# EAGLE design Maverick 1 (EAGLE 9.6.2)
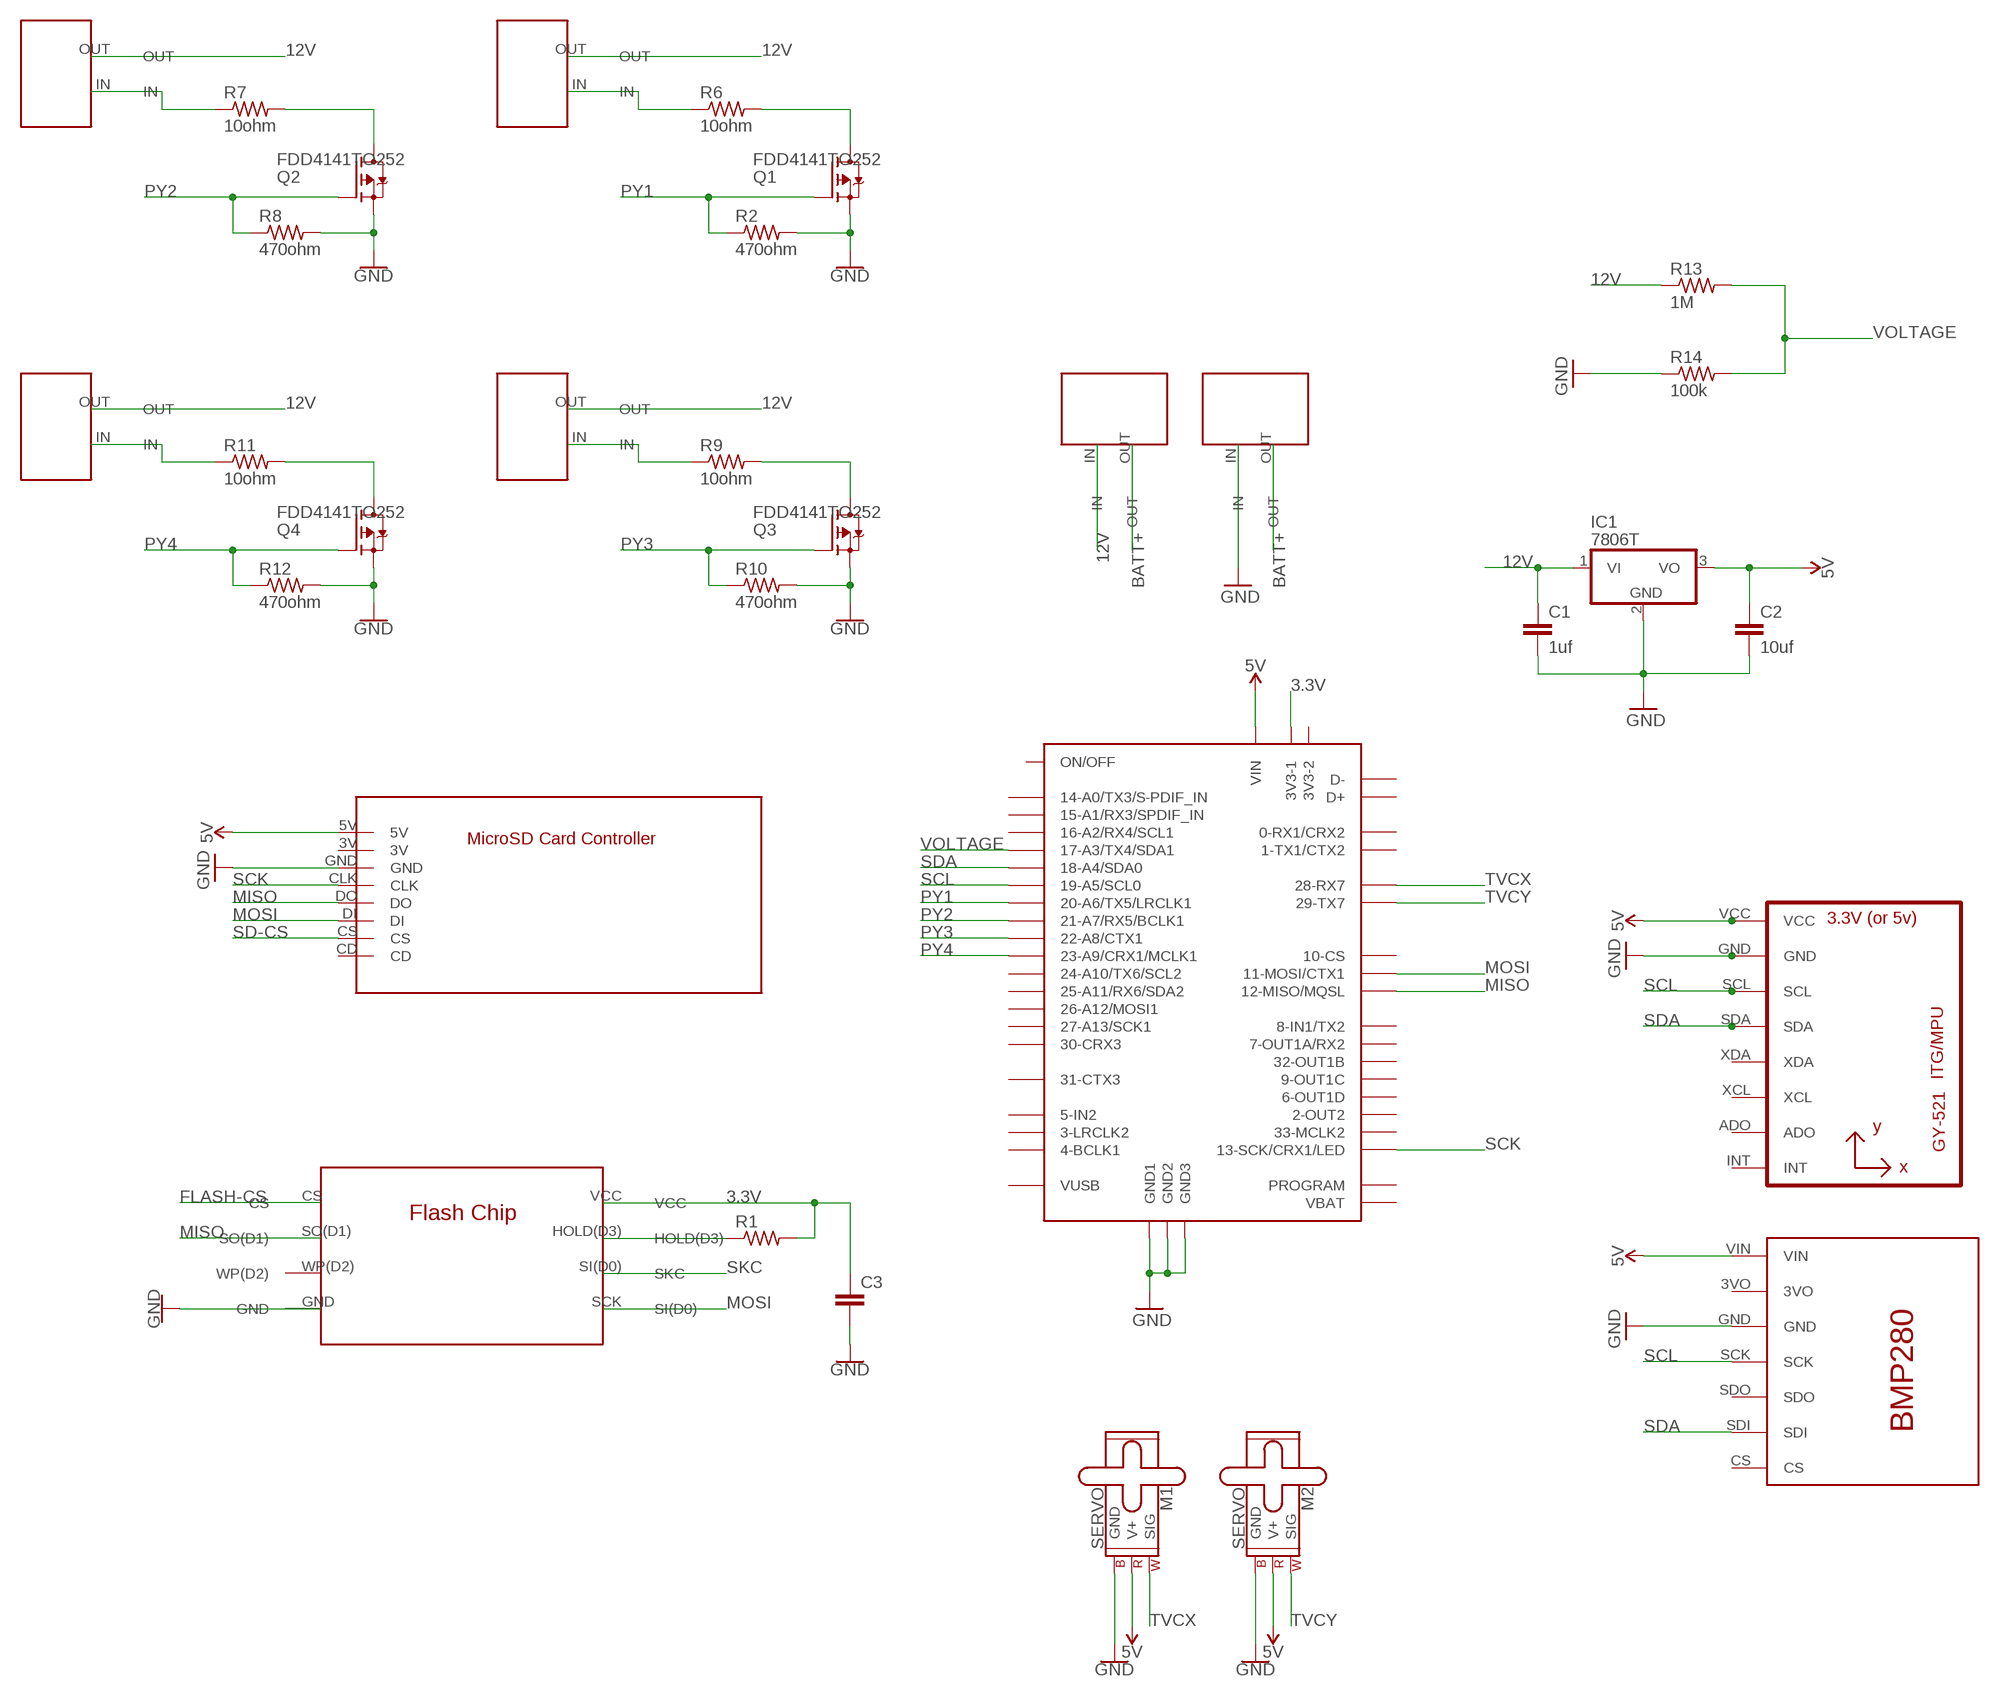
[diagram p0: schematic, sheet 1]

## Parts
C1  1uf  C2,5-3  [C2.5-3]
C2  10uf  C2,5-3  [C2.5-3]
C3  C2,5-3  [C2.5-3]
IC1  7806T  [TO220H]
M1  SERVO  [1X03]
M2  SERVO  [1X03]
Q1  FDD4141TO252  [TO252]
Q2  FDD4141TO252  [TO252]
Q3  FDD4141TO252  [TO252]
Q4  FDD4141TO252  [TO252]
R1  R-US_0411/3V  [0411V]
R2  470ohm  R-US_0411/15  [0411/15]
R6  10ohm  R-US_0411/3V  [0411V]
R7  10ohm  R-US_0411/3V  [0411V]
R8  470ohm  R-US_0411/15  [0411/15]
R9  10ohm  R-US_0411/3V  [0411V]
R10  470ohm  R-US_0411/15  [0411/15]
R11  10ohm  R-US_0411/3V  [0411V]
R12  470ohm  R-US_0411/15  [0411/15]
R13  1M  R-US_0411/15  [0411/15]
R14  100k  R-US_0411/15  [0411/15]
U4  GY-521MPU6050  [GY-521]
U$1  TEENSY40  [TEENSY40]
U$2  BMP280  [BMP280]
U$3  SDCARDHOLDER  [SDCARDHOLDER]
U$4  FLASHCHIP  [FLASHCHIP]
U$6  TERMBLOCK  [TERMBLOCK]
U$7  TERMBLOCK  [TERMBLOCK]
U$8  TERMBLOCK  [TERMBLOCK]
U$9  TERMBLOCK  [TERMBLOCK]
U$10  TERMBLOCK  [TERMBLOCK]
U$11  TERMBLOCK  [TERMBLOCK]

## Nets
3.3V: C3.1 R1.2 U$1.3V3-1 U$4.VCC
5V: C2.1 IC1.3(VO) M1.2(V+) M2.2(V+) U4.VCC U$1.VIN U$2.VIN U$3.5V
12V: C1.1 IC1.1(VI) R13.1 U$6.OUT U$7.OUT U$8.OUT U$9.OUT U$11.IN
BATT+: U$10.OUT U$11.OUT
FLASH-CS: U$4.CS
GND: C1.2 C2.2 C3.2 IC1.2(GND) M1.3(GND) M2.3(GND) Q1.2(S) Q2.2(S) Q3.2(S) Q4.2(S) R2.2 R8.2 R10.2 R12.2 R14.1 U4.GND U$1.GND1 U$1.GND2 U$1.GND3 U$2.GND U$3.GND U$4.GND U$10.IN
MISO: U$1.12-MIO/MQSL(12-MISO/MQSL) U$3.DO U$4.SO(D1)
MOSI: U$1.11-MOSI/CTX1 U$3.DI U$4.SCK(SI(D0))
N$1: R1.1 U$4.HOLD(D3)
N$9: Q1.3(D) R6.2
N$10: R6.1 U$6.IN
N$12: R7.1 U$7.IN
N$13: Q2.3(D) R7.2
N$15: R9.1 U$8.IN
N$16: Q3.3(D) R9.2
N$18: R11.1 U$9.IN
N$19: Q4.3(D) R11.2
PY1: Q1.1(G) R2.1 U$1.20-A6/TX5/LRCLK1
PY2: Q2.1(G) R8.1 U$1.21-A7/RX5/BCLK1
PY3: Q3.1(G) R10.1 U$1.22-A8/CTX1
PY4: Q4.1(G) R12.1 U$1.23-A9/CRX1/CCLK1(23-A9/CRX1/MCLK1)
SCK: U$1.13-SCK/CRX1/LED U$3.CLK
SCL: U4.SCL U$1.19-A5/SCL0 U$2.SCK
SD-CS: U$3.CS
SDA: U4.SDA U$1.18-A4/SDA0 U$2.SDI
SKC: U$4.SI(D0)(SKC)
TVCX: M1.1(SIG) U$1.28-RX7
TVCY: M2.1(SIG) U$1.29-TX7
VOLTAGE: R13.2 R14.2 U$1.17-A3/TX4/SDA1
Unconnected: U4.ADO U4.INT U4.XCL U4.XDA U$1.0-RX1(0-RX1/CRX2) U$1.1-TX1(1-TX1/CTX2) U$1.2-OUT2 U$1.3-LRCLK2 U$1.3V3-2 U$1.4-BCLK2(4-BCLK1) U$1.5-IN2 U$1.6-OUT1D U$1.7-RX2/OUT1A(7-OUT1A/RX2) U$1.8-TX2/IN1(8-IN1/TX2) U$1.9-OUT1C U$1.10-CS/MQSR(10-CS) U$1.14-A0/TX3/S-PFI_OUT(14-A0/TX3/S-PDIF_IN) U$1.15-A1/RX3/S-PDIF_IN(15-A1/RX3/SPDIF_IN) U$1.16-A2/RX4/SCL1 U$1.24-A10/TX6/SCL2 U$1.25-A11/SDA2(25-A11/RX6/SDA2) U$1.26-A12/MOSI1 U$1.27-A13/SCK1 U$1.30-CRX3 U$1.31-CTX3 U$1.32-OUTB1(32-OUT1B) U$1.33-MCLK2 U$1.D+ U$1.D- U$1.ON/OFF U$1.PROGRAM U$1.VBAT U$1.VUSB U$2.3VO U$2.CS U$2.SDO U$3.3V U$3.CD U$4.WP(D2)

## Library data of the parts
C1-C3 = capacitor-wima:C: CAPACITOR naming: grid - package width
IC1 = linear:78*: Positive VOLTAGE REGULATOR Source: http://cache.national.com/ds/LM/LM78L05.pdf http://www.fairchildsemi.com/ds/LM/LM7805.pdf
M1 M2 = SparkFun-Electromechanical:SERVO: Servo Motor 3-pin connector for a standard servo motor (voltage supply, ground, and control signal.) SparkFun Products Servo - Generic (Sub-Micro Size) <https://www.sparkfun.com/products/9065> (ROB-09065) Servo - Generic High Torque Continuous Rotation (Standard Size) <https://www.sparkfun.com/products/9347> (ROB-09347) Servo - Generic High Torque (Standard Size) <https://www.sparkfun.com/products/11965> (ROB-11965)
Q1-Q4 = transistor-fet:FDD4141: P-Channel PowerTrench® MOSFET Source: FDD4141.pdf
R1 R2 R6-R14 = rcl:R-US_: RESISTOR, American symbol; SPICEPREFIX: R
U4 = gy-521:GY-521
U$1 = teensy:TEENSY40: Teensy 4.0 device including POGO pins for pins 24 - 33, but not yet pins for D+ and D-. Symbol layout is what works for me and may not suite everyone... that can be added or additional symbols can be created to be used in a modilied davie name.
U$2 = BMP280:BMP280
U$3 = MicroSD Card Controller:SDCARDHOLDER
U$4 = Flash Chip:FLASHCHIP
U$6-U$11 = Terminal Block:TERMBLOCK

## Board
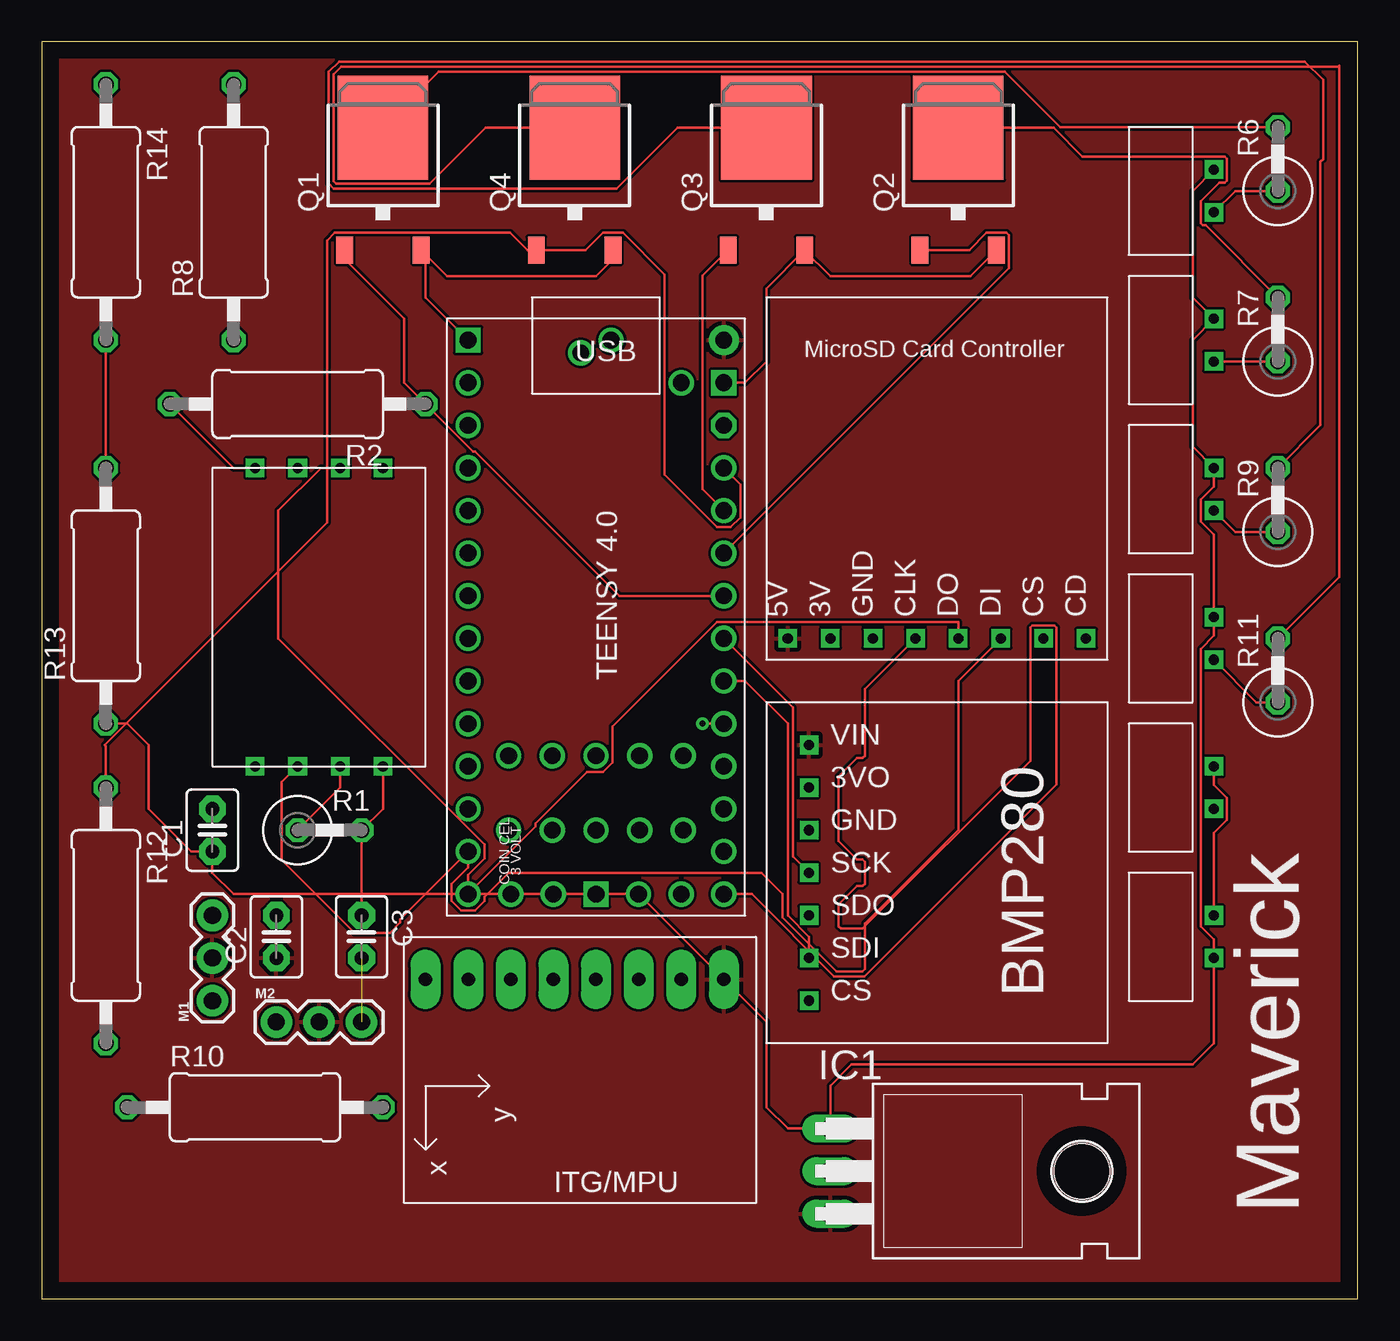
[diagram p1: board, top side]
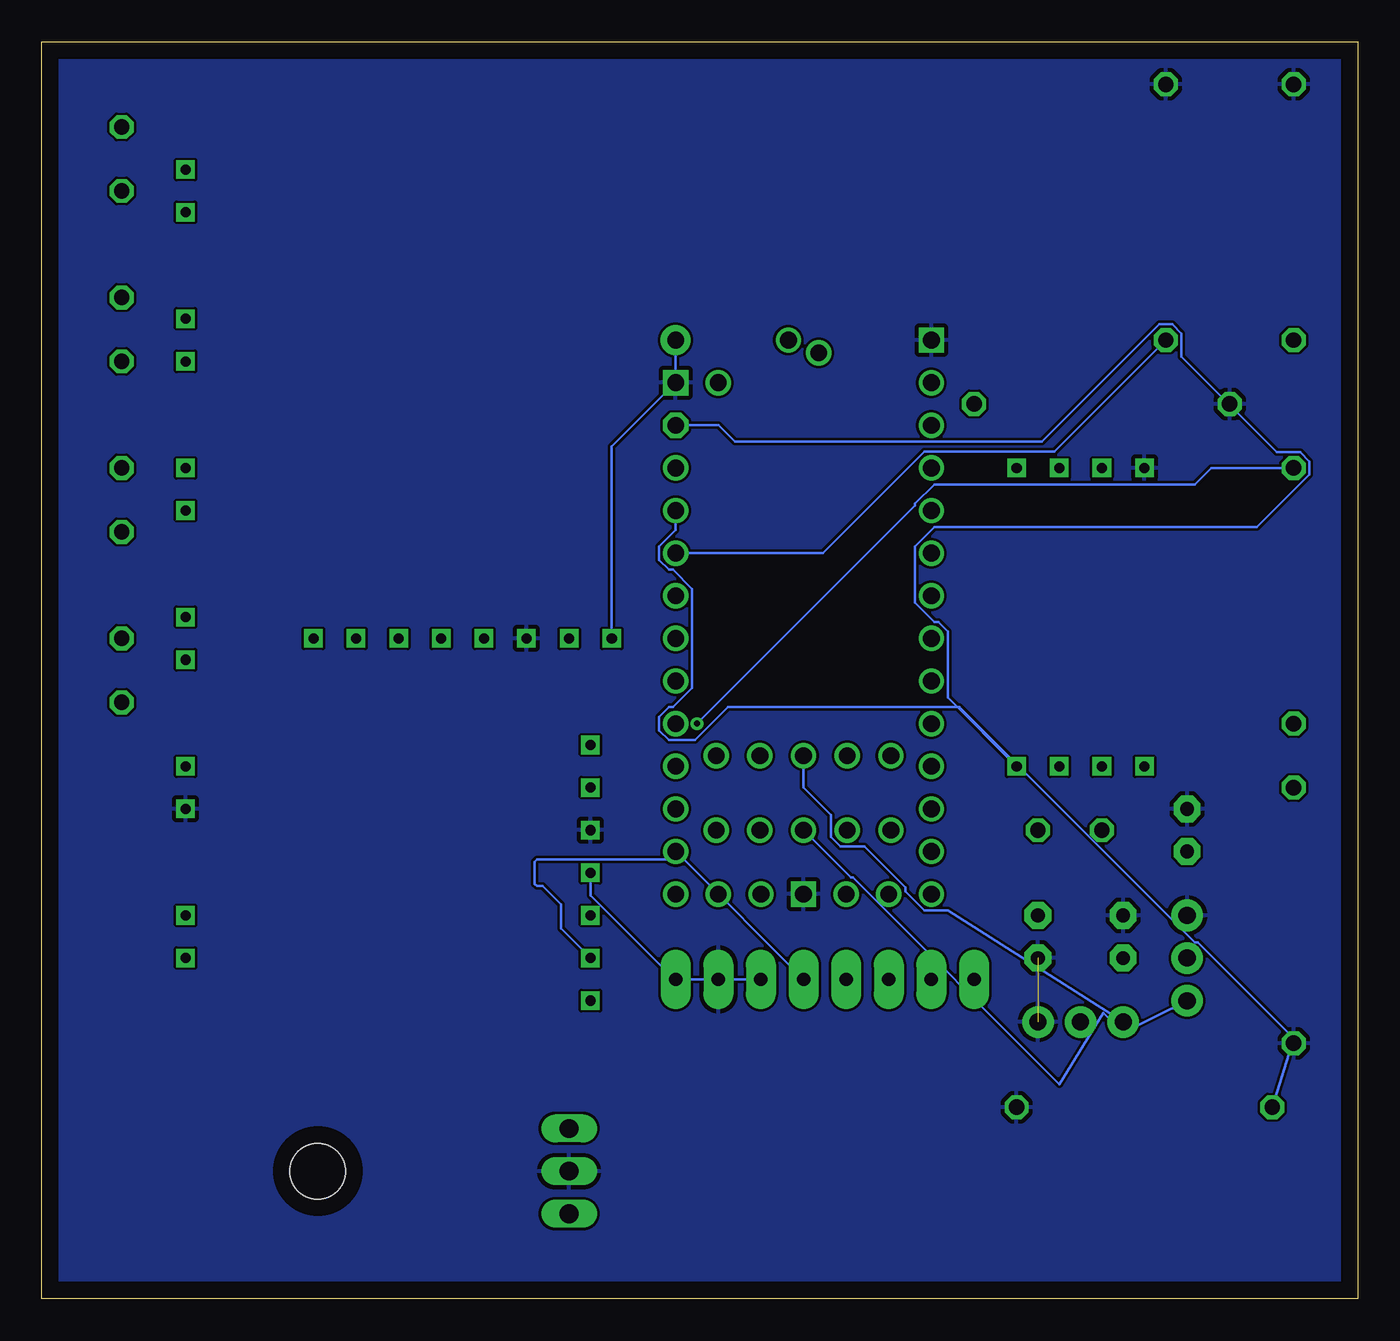
[diagram p2: board, bottom side, seen from below]

Size 78.41 x 74.92 mm. Coordinates in mm from the lower left corner, seen from the top.
Outline: 0,0 78.41,0 78.41,74.92 0,74.92 0,0
Copper layers (1*16): Top 0.035mm / dielectric 1.5mm / Bottom 0.035mm
Design rules "default": minimum track width 6mil, minimum drill 0.35mm, track to track 6mil, track to pad 6mil, pad to pad 6mil, via to via 6mil, smd to smd 6mil, copper to edge 40mil, drill to drill 6mil, minimum pad ring 10mil, minimum via ring 8mil, stop-mask expansion 4mil, vias tented up to drill 0mil, thermal gap 10mil

### Footprints (pad centres in the part's own frame; a part is rotated, then mirrored left to right if it is on the bottom)
C2.5-3 = drill 0.813 pad 1.6 octagon: 1 -1.27,0; 2 1.27,0
TO220H = drill 1.118 long: 1 -2.54,-10.16; 2 0,-10.16; 3 2.54,-10.16 | hole 3.302: 0,4.826
1X03 = drill 1.016 pad 1.88: 1 0,0; 2 2.54,0; 3 5.08,0
TO252 = smd 1 x 1.6: 1 -2.28,-4.8; 2 2.28,-4.8 | smd 5.4 x 6.2: 3 0,2.5
0411V = drill 0.914 octagon: 1 -2.54,0; 2 1.27,0
0411/15 = drill 0.914 octagon: 1 -7.62,0; 2 7.62,0
GY-521 = drill 0.8 pad 1.778 long: ADO -8.89,-6.35; GND -8.89,6.35; INT -8.89,-8.89; SCL -8.89,3.81; SDA -8.89,1.27; VCC -8.89,8.89; XCL -8.89,-3.81; XDA -8.89,-1.27
TEENSY40 = drill 1: 0-RX1 -13.97,-7.62; 1-TX1 -11.43,-7.62; 2-OUT2 -8.89,-7.62; 3-LRCLK2 -6.35,-7.62; 3V3-2 16.51,-2.54; 4-BCLK2 -3.81,-7.62; 5-IN2 -1.27,-7.62; 6-OUT1D 1.27,-7.62; 7-RX2/OUT1A 3.81,-7.62; 8-TX2/IN1 6.35,-7.62; 9-OUT1C 8.89,-7.62; 10-CS/MQSR 11.43,-7.62; 11-MOSI/CTX1 13.97,-7.62; 12-MIO/MQSL 16.51,-7.62; 13-SCK/CRX1/LED 16.51,7.62; 14-A0/TX3/S-PFI_OUT 13.97,7.62; 15-A1/RX3/S-PDIF_IN 11.43,7.62; 16-A2/RX4/SCL1 8.89,7.62; 17-A3/TX4/SDA1 6.35,7.62; 18-A4/SDA0 3.81,7.62; 19-A5/SCL0 1.27,7.62; 20-A6/TX5/LRCLK1 -1.27,7.62; 21-A7/RX5/BCLK1 -3.81,7.62; 22-A8/CTX1 -6.35,7.62; 23-A9/CRX1/CCLK1 -8.89,7.62; 24-A10/TX6/SCL2 12.7,5.207; 25-A11/SDA2 8.255,5.207; 26-A12/MOSI1 12.7,2.603; 27-A13/SCK1 8.255,2.603; 28-RX7 12.7,0; 29-TX7 8.255,0; 30-CRX3 12.7,-2.603; 31-CTX3 8.255,-2.603; 32-OUTB1 12.7,-5.207; 33-MCLK2 8.255,-5.207; D+ -15.75,-0.9; D- -16.51,0.9; ON/OFF 16.51,5.08; PROGRAM 16.51,2.54; VBAT 16.51,-5.08; VUSB -13.97,5.08 | drill 1 octagon: 3V3-1 -11.43,7.62 | drill 1 square: GND1 -16.51,-7.62; GND2 16.51,0; GND3 -13.97,7.62 | drill 1 pad 1.778: VIN -16.51,7.62
BMP280 = drill 0.6 square: 3VO -5.08,-7.62; CS 7.62,-7.62; GND -2.54,-7.62; SCK 0,-7.62; SDI 5.08,-7.62; SDO 2.54,-7.62; VIN -7.62,-7.62
SDCARDHOLDER = drill 0.6 square: 3V -8.89,3.81; 5V -8.89,6.35; CD -8.89,-11.43; CLK -8.89,-1.27; CS -8.89,-8.89; DI -8.89,-6.35; DO -8.89,-3.81; GND -8.89,1.27
FLASHCHIP = drill 0.6 square: CS -8.89,3.81; GND -8.89,-3.81; HOLD(D3) 8.89,1.27; SCK 8.89,-1.27; SI(D0) 8.89,-3.81; SO(D1) -8.89,1.27; VCC 8.89,3.81; WP(D2) -8.89,-1.27
TERMBLOCK = drill 0.6 square: IN -1.27,-3.81; OUT 1.27,-3.81

### Placement (x,y rotation side)
C1  10.16,27.94 90 top
C2  13.97,21.59 90 top
C3  19.05,21.59 270 top
IC1  57.15,7.62 270 top
M1  10.16,17.78 90 top
M2  13.97,16.51 0 top
Q1  20.32,67.31 0 top
Q2  54.61,67.31 0 top
Q3  43.18,67.31 0 top
Q4  31.75,67.31 0 top
R1  17.78,27.94 0 top
R2  15.24,53.34 180 top
R6  73.66,68.58 90 top
R7  73.66,58.42 90 top
R8  11.43,64.77 90 top
R9  73.66,48.26 90 top
R10  12.7,11.43 0 top
R11  73.66,38.1 90 top
R12  3.81,22.86 270 top
R13  3.81,41.91 90 top
R14  3.81,64.77 270 top
U4  31.75,10.16 270 top
U$1  33.02,40.64 270 top
U$2  53.34,25.4 270 top
U$3  50.8,48.26 90 top
U$4  16.51,40.64 270 top
U$6  66.04,66.04 90 top
U$7  66.04,57.15 90 top
U$8  66.04,48.26 90 top
U$9  66.04,39.37 90 top
U$10  66.04,30.48 90 top
U$11  66.04,21.59 90 top

### Tracks (layer width: path | path; a pad name or v marks a point on that pad's centre or on a via)
3.3V
  Top 0.152: U$4.VCC 20.32,29.21 R1.2 C3.1
  Bottom 0.152: U$1.3V3-1 38.1,52.07 37.12,51.09 18.82,51.09 11.82,58.09 11.04,58.09 10.49,57.54 10.49,56.15 4.81,50.47 3.42,50.47 2.87,49.92 2.87,49.14 6,46.01 25.23,46.01 26.38,44.86 26.38,41.5 25.23,40.35 24.99,40.35 24.42,39.78 24.42,35.85 U$4.VCC
5V
  Bottom 0.152: U$1.VIN 40.64,54.61 44.45,50.8 U$3.5V
  pour Top: -2.54,77.93 -2.54,-2.54 81.28,-2.54 81.28,77.93
12V
  Top 0.152: U$6.OUT 68.58,66.04 68.58,59.69 U$7.OUT 68.58,57.15 68.58,50.8 U$8.OUT 69.85,48.42 69.07,47.64 69.07,46.34 69.85,45.56 U$9.OUT 69.85,39.53 69.07,38.75 69.07,22.21 69.85,21.43 U$11.IN 69.85,15.24 68.58,13.97 48.26,13.97 46.99,12.7 IC1.1 44.45,10.16 43.18,11.43 43.18,16.51 35.56,24.13 11.43,24.13 10.16,25.4 C1.1 8.89,26.67 6.35,29.21 6.35,33.02 5.08,34.29 R13.1
BATT+
  Top 0.152: U$10.OUT 69.85,30.64 70.63,29.86 70.63,28.56 69.85,27.78 U$11.OUT
GND  (1 unrouted)
  Top 0.152: Q4.2 34.03,61.97 33.02,60.96 24.15,60.96 Q1.2 22.86,62.25 22.86,59.69 U$1.GND1 | Q2.2 55.34,60.96 46.99,60.96 45.46,62.49 Q3.2 43.18,60.23 43.18,55.88 41.91,54.61 U$1.GND3 | U$4.GND 11.43,49.53 R2.2
  pour Bottom: -2.54,76.2 -2.54,-1.27 80.01,-1.27 80.01,76.2
MISO
  Top 0.152: U$4.SO(D1) 16.63,49.53 14.09,46.99 14.09,39.37 26.38,27.08 26.38,26.26 25.4,25.28 U$1.12-MIO/MQSL 29.43,28.16 29.43,28.35 32.49,31.4 33.43,31.4 34,31.98 34,34.12 40.23,40.35 54.61,40.35 U$3.DO
MOSI
  Top 0.152: U$4.SCK 14.3,30.81 14.3,26.16 18.62,21.83 20.75,21.83 21.35,22.43 21.35,22.62 U$1.11-MOSI/CTX1 25.4,25.71 24.42,24.73 24.42,23.72 24.99,23.15 25.81,23.15 26.38,23.72 26.38,23.96 27.82,25.4 42.88,25.4 44.15,24.13 44.15,22.73 47.34,19.54 48.91,19.54 49.04,19.67 49.04,22.37 54.61,27.94 54.61,36.83 U$3.DI
N$1
  Top 0.152: U$4.HOLD(D3) 17.78,30.48 R1.1
N$9
  Top 0.152: R6.2 60.69,69.85 57.41,73.14 23.65,73.14 Q1.3
N$10
  Top 0.152: R6.1 71.12,66.04 U$6.IN
N$12
  Top 0.152: R7.1 U$7.IN
N$13
  Top 0.152: Q2.3 60.3,69.81 62.02,68.09 70.5,68.09 70.63,67.96 70.63,66.66 70.5,66.53 70.18,66.53 69.07,65.42 69.07,64.12 69.2,63.99 69.36,63.99 R7.2
N$15
  Top 0.152: R9.1 71.12,45.72 U$8.IN
N$16
  Top 0.152: Q3.3 37.87,69.81 34.24,66.18 17.4,66.18 17.09,66.49 17.09,73.13 17.7,73.75 75.27,73.75 76.35,72.67 76.35,67.95 76.2,67.79 76.2,52.07 R9.2
N$18
  Top 0.152: R11.1 72.39,35.56 U$9.IN
N$19
  Top 0.152: Q4.3 26.44,69.81 23.12,66.48 17.53,66.48 17.39,66.61 17.39,73 17.83,73.44 77.25,73.44 77.32,73.51 77.32,43.03 R11.2
PY1
  Top 0.152: Q1.1 18.04,61.97 21.59,58.42 21.59,54.61 R2.1 25.69,50.51 25.81,50.51 34.41,41.91 U$1.20-A6/TX5/LRCLK1
PY2
  Top 0.152: U$1.21-A7/RX5/BCLK1 57.62,61.43 57.62,63.41 57.48,63.54 56.3,63.54 55.27,62.51 Q2.1
  Bottom 0.152: U$1.21-A7/RX5/BCLK1 31.87,44.45 25.81,50.51 18.07,50.51 R8.1
PY3
  Top 0.152: Q3.1 39.37,60.98 39.37,48.26 U$1.22-A8/CTX1
  Bottom 0.152: R10.1 3.81,15.54 9.52,21.26 9.71,21.26 23.72,35.27 37.53,35.27 39.49,33.31 41.05,33.31 41.62,33.88 41.62,34.7 41.05,35.27 40.81,35.27 39.66,36.42 39.66,42.32 40.81,43.47 41.05,43.47 41.62,44.04 41.62,44.86 40.64,45.84 U$1.22-A8/CTX1
PY4
  Top 0.152: R12.1 3.81,32.96 3.75,33.02 17,46.27 17,63.09 17.45,63.54 27.9,63.54 28.93,62.51 Q4.1 32.41,62.51 33.44,63.54 34.62,63.54 37.12,61.05 37.12,49.12 40.23,46.01 41.05,46.01 41.62,46.58 41.62,48.55 U$1.23-A9/CRX1/CCLK1
SCK
  Top 0.152: U$3.CLK 49.04,36.34 49.04,32.37 48.91,32.24 48.59,32.24 47.48,31.13 47.48,27.29 48.59,26.18 48.91,26.18 49.04,26.05 49.04,24.75 48.91,24.62 48.59,24.62 47.48,23.51 47.48,22.21 47.61,22.08 48.91,22.08 58.91,32.08 58.91,40.02 59.04,40.15 60.34,40.15 60.47,40.02 60.47,30.67 49.04,19.23 47.22,19.23 42.32,24.13 U$1.13-SCK/CRX1/LED
SCL
  Top 0.152: U$1.19-A5/SCL0 44.76,35.26 44.76,26.37 U$2.SCK
  Bottom 0.152: U$2.SCK 45.72,24.06 40.71,19.05 U4.SCL
SDA
  Top 0.152: U$1.18-A4/SDA0 41.91,36.83 44.45,34.29 44.45,22.86 45.72,21.59 U$2.SDI
  Bottom 0.152: U$2.SDI 47.48,22.08 47.48,23.51 48.59,24.62 48.91,24.62 49.04,24.75 49.04,26.05 48.91,26.18 40.15,26.18 U4.SDA
TVCX
  Bottom 0.152: U$1.28-RX7 30.19,25.11 30.07,25.11 17.76,12.8 15.14,17.06 13.97,15.89 M1.1
TVCY
  Bottom 0.152: U$1.29-TX7 33.02,30.48 31.4,28.86 31.4,27.53 30.82,26.96 29.38,26.96 26.96,24.54 26.96,24.3 25.81,23.15 24.42,23.15 M2.1
VOLTAGE  (via drill 0.35)
  Top 0.152: R14.2 R13.2 | U$1.17-A3/TX4/SDA1 v39.37,34.29
  Bottom 0.152: v39.37,34.29 26.38,47.28 26.38,47.4 25.23,48.55 9.71,48.55 8.73,49.53 R13.2

### Text on the board
tNames: Maverick